# Altium schematic sheet NFC_Access_IO_R00.SchDoc: NFC Access Board
size A4; Author: Hernan M. Travado; CompanyName: UTN FRBA; Revision: 1.0; SheetNumber: 7; SheetTotal: 7
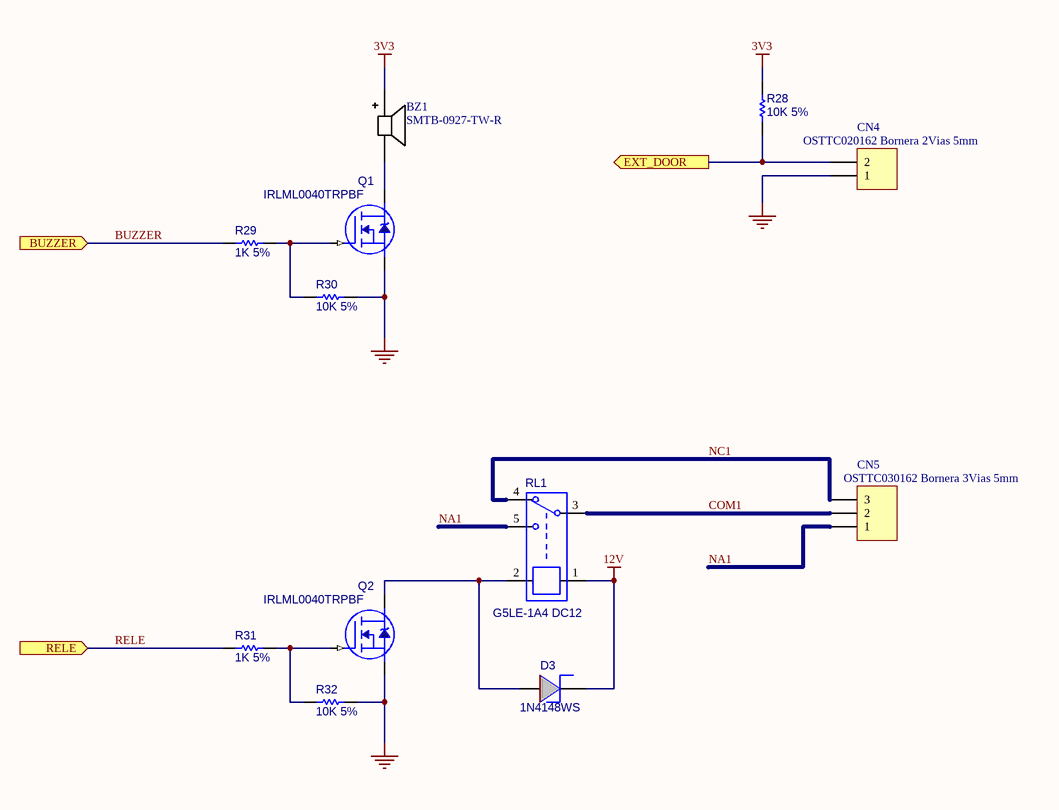
[diagram p0: NFC_Access_IO_R00.SchDoc]

## Parts
BZ1  SMTB-0927-TW-R  [SMTB-0927-TW-R]
CN4  OSTTC020162 Bornera 2Vias 5mm  [TerminalBlock_1x2_P5mm]
CN5  OSTTC030162 Bornera 3Vias 5mm  [TerminalBlock_1x3_P5mm]
D3  1N4148WS  [SOD_323]
Q1  IRLML0040TRPBF  [SOT_23]
Q2  IRLML0040TRPBF  [SOT_23]
R28  10K 5%  [R_0603]
R29  1K 5%  [R_0603]
R30  10K 5%  [R_0603]
R31  1K 5%  [R_0603]
R32  10K 5%  [R_0603]
RL1  G5LE-1A4 DC12  [G5LE-1]

## Ports
BUZZER (in, see NFC_Access_MainPage_R00[3C], NFC_Access_CPU1_R00[3B]), EXT_DOOR (out, see NFC_Access_MainPage_R00[3C], NFC_Access_CPU1_R00[3B]), RELE (in, see NFC_Access_MainPage_R00[3C], NFC_Access_CPU1_R00[3B])

## Nets
3V3: BZ1.1 R28.2
12V: D3.2(K) RL1.1
GND: CN4.1 Q1.2(SOURCE) Q2.2(SOURCE) R30.1 R32.1
BUZZER: R29.2 ; port BUZZER
COM1: CN5.2 RL1.3
EXT_DOOR: CN4.2 R28.1 ; port EXT_DOOR
NA1: CN5.1 RL1.5
NC1: CN5.3 RL1.4
RELE: R31.2 ; port RELE
NetBZ1_2: BZ1.2 Q1.3(DRAIN)
NetD3_1: D3.1(A) Q2.3(DRAIN) RL1.2
NetQ1_1: Q1.1(GATE) R29.1 R30.2
NetQ2_1: Q2.1(GATE) R31.1 R32.2

## Notes on the sheet
- Title:
- Size:
- Author:
- A4
- Sheet
- of
- Revision:
- File:
- Date:

## Library data of the parts
BZ1 = Buzzer: 3V3 Active Buzzer / 668-SMTB-0927-TW-RTR-ND
CN4 = CONN_02P: TERM BLK 2POS SIDE ENTRY 5MM PCB / ED2600-ND
CN5 = CONN_03P: TERM BLK 3POS SIDE ENTRY 5MM PCB / ED2601-ND
D3 = DIODO_SH: DIODE GEN PURP 75V 300MA SOD323 / 1655-1N4148WSTR-ND
Q1 Q2 = N_MOSFET_SOT23: Mosfet N-Ch / IRLML0040TRPBFTR-ND
R28 R30 R32 = Res1: Resistor / CR0603-JW-103ELFTR-ND
R29 R31 = Res1: Resistor / CR0603-JW-102ELFTR-ND
RL1 = RELAY SPDT: RELAY GEN PURPOSE SPST 10A 12V / Z2352-ND